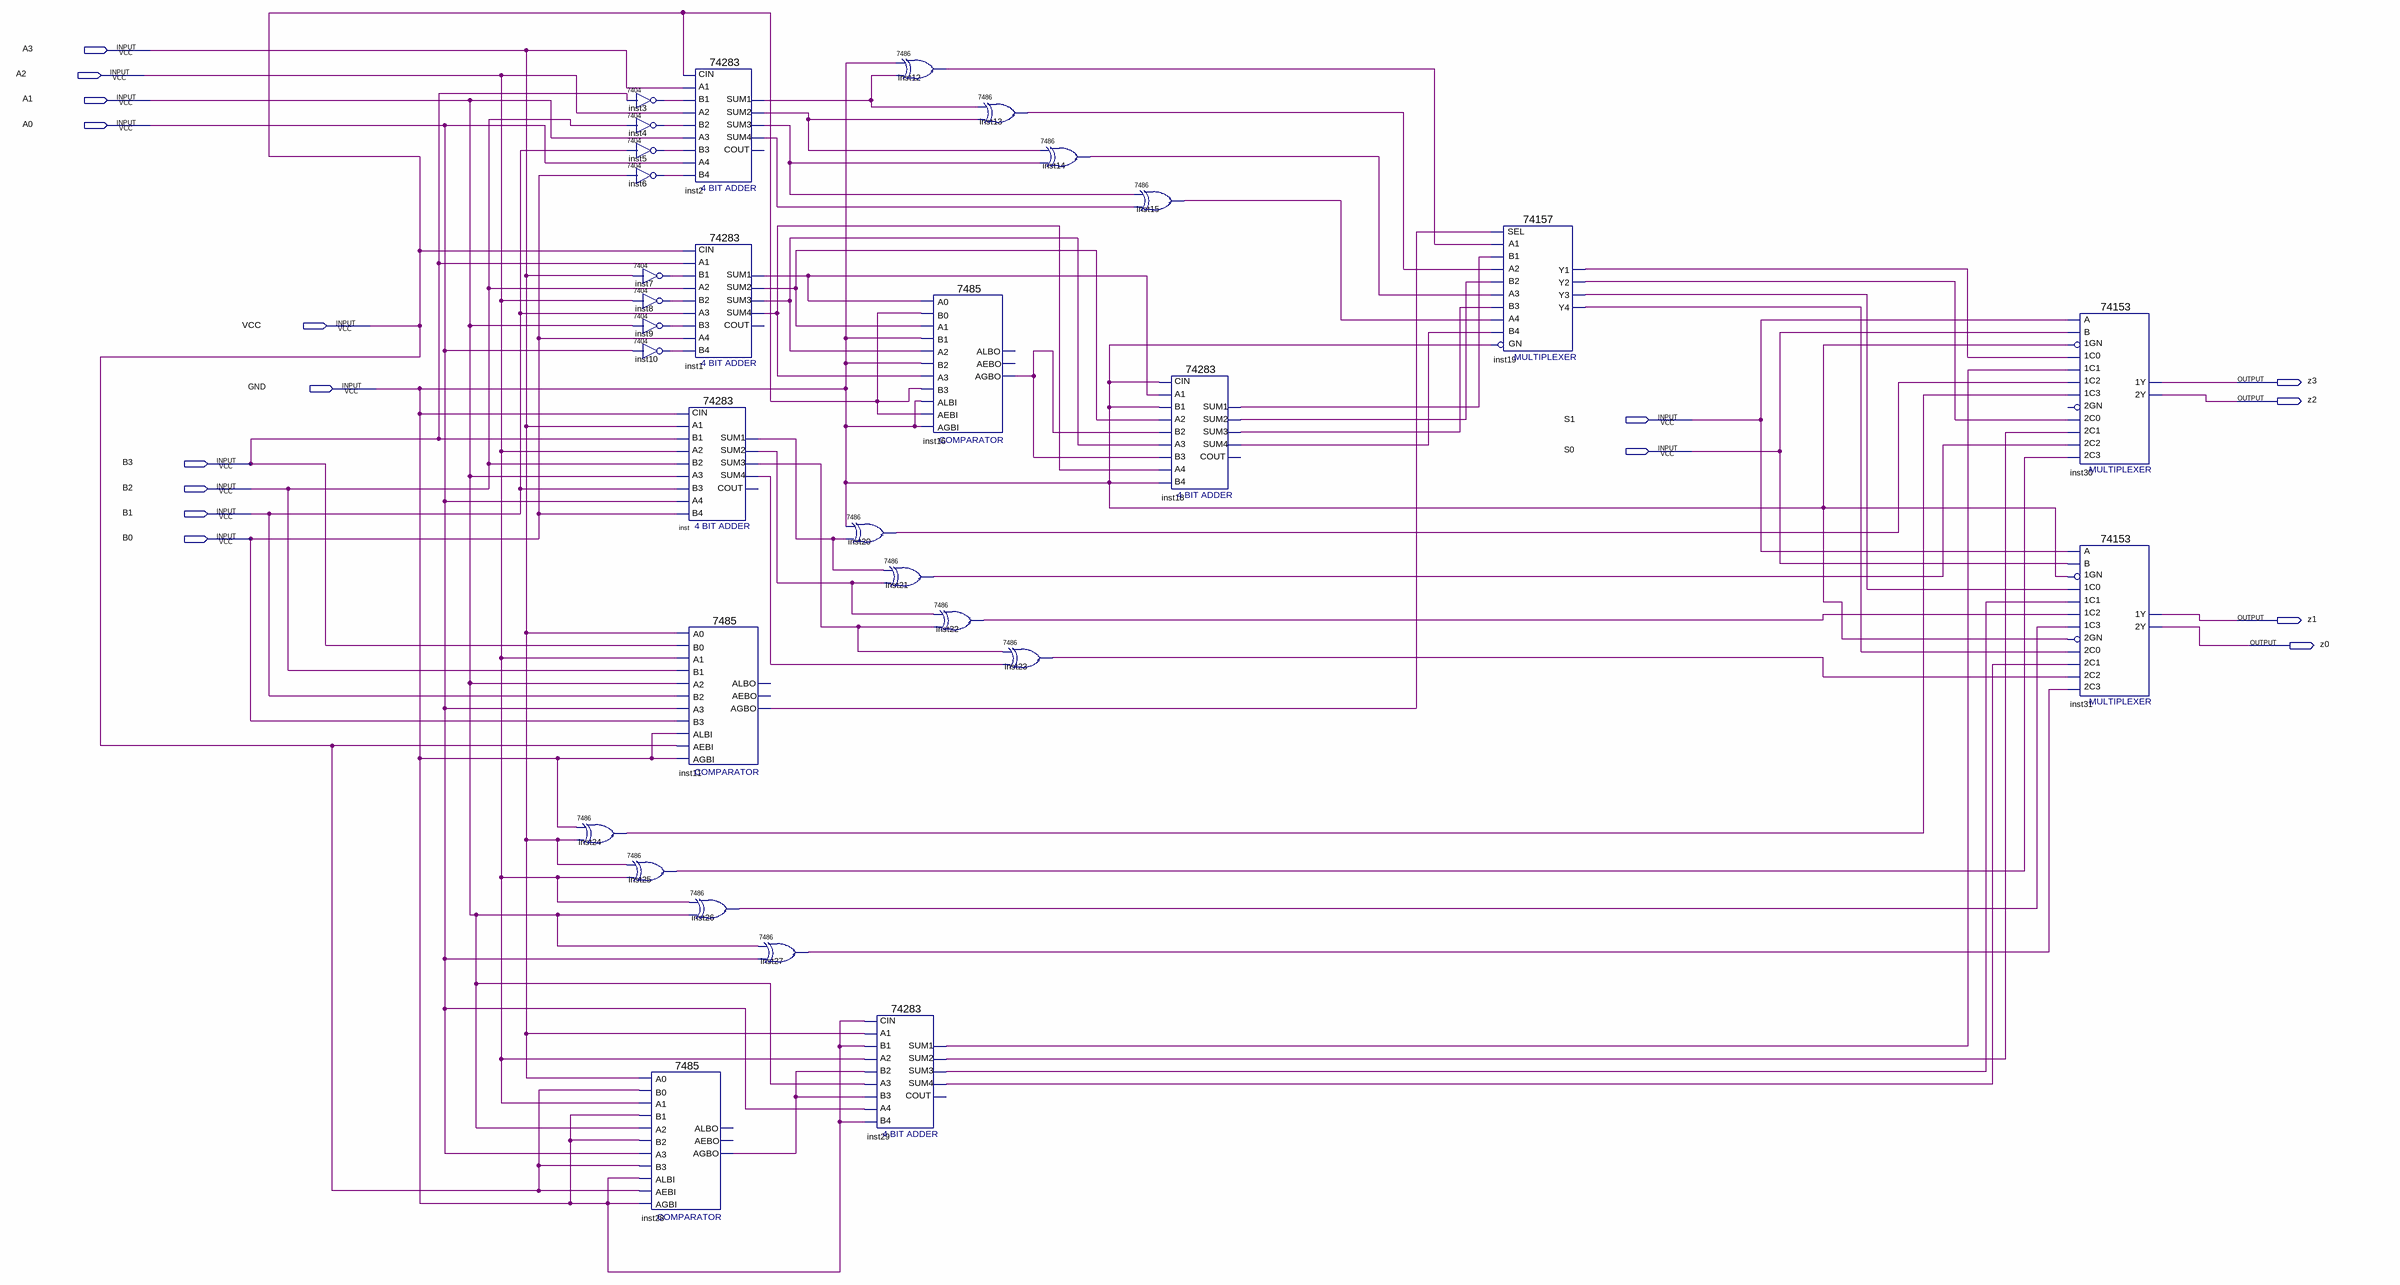
[diagram p0: schematic sheet]
// Quartus schematic Test1.bdf as structural Verilog: 31 symbols, 16 pins
module Test1 (
  input  A3,
  input  A2,
  input  A1,
  input  A0,
  input  VCC,
  input  GND,
  input  S1,
  input  S0,
  input  B3,
  input  B2,
  input  B1,
  input  B0,
  output z3,
  output z2,
  output z1,
  output z0
);

  wire inst1_sum1, inst1_sum2, inst1_sum3, inst1_sum4, inst2_sum1, inst2_sum2, inst2_sum3, inst2_sum4,
       inst3_1, inst4_1, inst5_1, inst6_1, inst7_1, inst8_1, inst9_1, inst10_1, inst11_agbo, inst12_1,
       inst13_1, inst14_1, inst15_1, inst16_agbo, inst18_sum1, inst18_sum2, inst18_sum3, inst18_sum4,
       inst19_y1, inst19_y2, inst19_y3, inst19_y4, inst20_1, inst21_1, inst22_1, inst23_1, inst24_1,
       inst25_1, inst26_1, inst27_1, inst28_agbo, inst29_sum1, inst29_sum2, inst29_sum3, inst29_sum4,
       inst_sum1, inst_sum2, inst_sum3, inst_sum4;

  \7486  inst24 (.\2 (GND), .\3 (A3), .\1 (inst24_1));
  \7404  inst3 (.\2 (B3), .\1 (inst3_1));
  \7404  inst4 (.\2 (B2), .\1 (inst4_1));
  \7404  inst5 (.\2 (B1), .\1 (inst5_1));
  \7404  inst6 (.\2 (B0), .\1 (inst6_1));
  \7404  inst7 (.\2 (A3), .\1 (inst7_1));
  \7404  inst8 (.\2 (A2), .\1 (inst8_1));
  \7404  inst9 (.\2 (A1), .\1 (inst9_1));
  \7404  inst10 (.\2 (A0), .\1 (inst10_1));
  \7486  inst25 (.\2 (A3), .\3 (A2), .\1 (inst25_1));
  \7485  inst28 (
    .A3(A0), .B2(GND), .A2(A1), .AEBI(VCC), .AGBI(GND), .ALBI(GND), .A0(A3), .B0(VCC), .B3(VCC), .A1(A2),
    .B1(GND), .AGBO(inst28_agbo));  // open: ALBO, AEBO
  \74283  inst2 (
    .CIN(VCC), .A1(A3), .A2(A2), .B2(inst4_1), .A3(A1), .A4(A0), .B4(inst6_1), .B1(inst3_1), .B3(inst5_1),
    .SUM4(inst2_sum4), .SUM1(inst2_sum1), .SUM2(inst2_sum2), .SUM3(inst2_sum3));  // open: COUT
  \74283  inst1 (
    .CIN(VCC), .A1(B3), .A2(B2), .B2(inst8_1), .A3(B1), .A4(B0), .B4(inst10_1), .B1(inst7_1), .B3(inst9_1),
    .SUM4(inst1_sum4), .SUM1(inst1_sum1), .SUM2(inst1_sum2), .SUM3(inst1_sum3));  // open: COUT
  \74283  inst (
    .CIN(GND), .A1(A3), .A2(A2), .B2(B2), .A3(A1), .A4(A0), .B4(B0), .B1(B3), .B3(B1), .SUM4(inst_sum4),
    .SUM1(inst_sum1), .SUM2(inst_sum2), .SUM3(inst_sum3));  // open: COUT
  \7485  inst11 (
    .A3(A0), .B2(B1), .A2(A1), .AEBI(VCC), .AGBI(GND), .ALBI(GND), .A0(A3), .B0(B3), .B3(B0), .A1(A2),
    .B1(B2), .AGBO(inst11_agbo));  // open: ALBO, AEBO
  \7486  inst26 (.\2 (A2), .\3 (A1), .\1 (inst26_1));
  \7486  inst27 (.\2 (A1), .\3 (A0), .\1 (inst27_1));
  \7486  inst20 (.\2 (GND), .\3 (inst_sum1), .\1 (inst20_1));
  \7486  inst12 (.\2 (GND), .\3 (inst2_sum1), .\1 (inst12_1));
  \7486  inst21 (.\2 (inst_sum1), .\3 (inst_sum2), .\1 (inst21_1));
  \74283  inst29 (
    .CIN(GND), .A1(A3), .A2(A2), .B2(inst28_agbo), .A3(A1), .A4(A0), .B4(GND), .B1(GND), .B3(inst28_agbo),
    .SUM4(inst29_sum4), .SUM1(inst29_sum1), .SUM2(inst29_sum2), .SUM3(inst29_sum3));  // open: COUT
  \7485  inst16 (
    .A3(inst1_sum4), .B2(GND), .A2(inst1_sum3), .AEBI(VCC), .AGBI(GND), .ALBI(GND), .A0(inst1_sum1),
    .B0(VCC), .B3(VCC), .A1(inst1_sum2), .B1(GND), .AGBO(inst16_agbo));  // open: ALBO, AEBO
  \7486  inst22 (.\2 (inst_sum2), .\3 (inst_sum3), .\1 (inst22_1));
  \7486  inst13 (.\2 (inst2_sum1), .\3 (inst2_sum2), .\1 (inst13_1));
  \7486  inst23 (.\2 (inst_sum3), .\3 (inst_sum4), .\1 (inst23_1));
  \7486  inst14 (.\2 (inst2_sum2), .\3 (inst2_sum3), .\1 (inst14_1));
  \7486  inst15 (.\2 (inst2_sum3), .\3 (inst2_sum4), .\1 (inst15_1));
  \74283  inst18 (
    .CIN(GND), .A1(inst1_sum1), .A2(inst1_sum2), .B2(inst16_agbo), .A3(inst1_sum3), .A4(inst1_sum4),
    .B4(GND), .B1(GND), .B3(inst16_agbo), .SUM4(inst18_sum4), .SUM1(inst18_sum1), .SUM2(inst18_sum2),
    .SUM3(inst18_sum3));  // open: COUT
  \74157  inst19 (
    .A1(inst12_1), .B1(inst18_sum1), .SEL(inst11_agbo), .B2(inst18_sum2), .A3(inst14_1), .B3(inst18_sum3),
    .A2(inst13_1), .B4(inst18_sum4), .GN(GND), .A4(inst15_1), .Y2(inst19_y2), .Y1(inst19_y1), .Y4(inst19_y4),
    .Y3(inst19_y3));
  \74153  inst30 (
    .\1C1 (inst29_sum1), .\1GN (GND), .\1C0 (inst19_y1), .\2C0 (inst19_y2), .\2C2 (inst21_1),
    .\1C2 (inst20_1), .\1C3 (inst24_1), .B(S0), .A(S1), .\2C1 (inst29_sum2), .\2C3 (inst25_1), .\1Y (z3),
    .\2Y (z2));  // open: 2GN
  \74153  inst31 (
    .\1C1 (inst29_sum3), .\1GN (GND), .\1C0 (inst19_y3), .\2C0 (inst19_y4), .\2GN (GND), .\2C2 (inst23_1),
    .\1C2 (inst22_1), .\1C3 (inst26_1), .B(S0), .A(S1), .\2C1 (inst29_sum4), .\2C3 (inst27_1), .\1Y (z1),
    .\2Y (z0));
endmodule
